# Altium schematic sheet cc2530.SchDoc
size A3
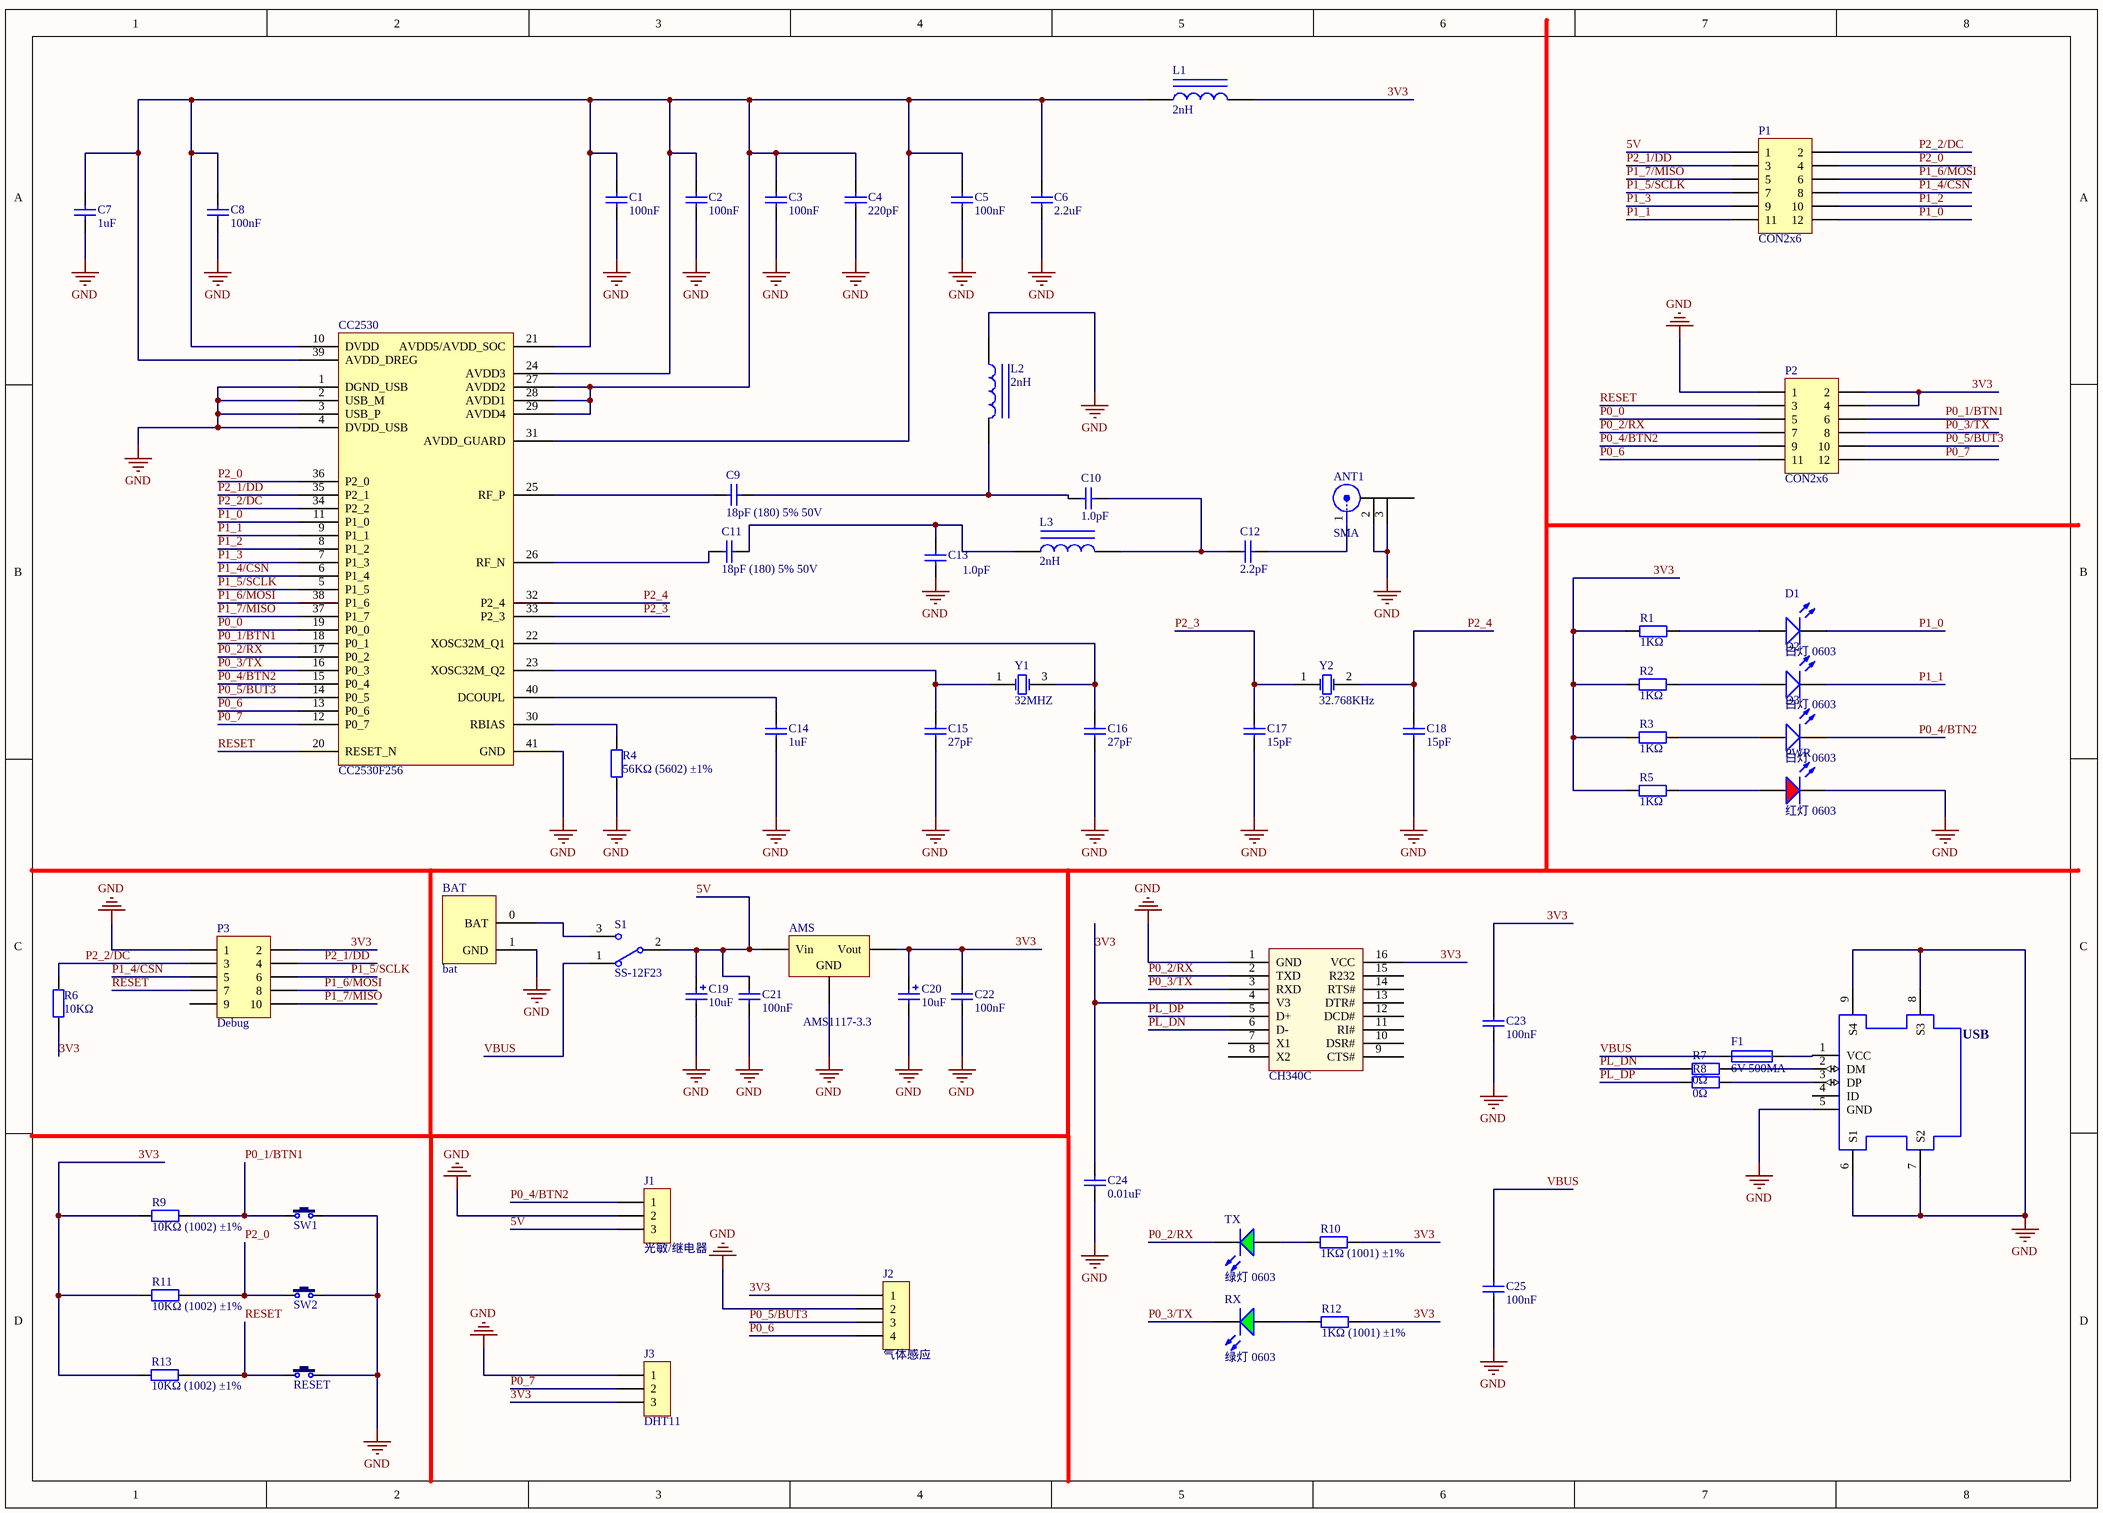
[diagram p0: cc2530.SchDoc]

## Parts
AMS  AMS1117-3.3  [SOT-223]
ANT1  SMA  [SMA-KE]
BAT  bat  [BAT]
C1  100nF  [0603_C]
C2  100nF  [0603_C]
C3  100nF  [0603_C]
C4  220pF  [0603_C]
C5  100nF  [0603_C]
C6  2.2uF  [0603_C]
C7  1uF  [0603_C]
C8  100nF  [0603_C]
C9  18pF (180) 5% 50V  [0603_C]
C10  1.0pF  [0805_C]
C11  18pF (180) 5% 50V  [0603_C]
C12  2.2pF  [0603_C]
C13  1.0pF  [0805_C]
C14  1uF  [0603_C]
C15  27pF  [0603_C]
C16  27pF  [0603_C]
C17  15pF  [0603_C]
C18  15pF  [0603_C]
C19  10uF  [CASE-A_3216]
C20  10uF  [CASE-A_3216]
C21  100nF  [0603_C]
C22  100nF  [0603_C]
C23  100nF  [0603_C]
C24  0.01uF  [0603_C]
C25  100nF  [0603_C]
CC2530  CC2530F256  [PVQFN-N40]
CH340C  CH340C  [SOIC-16_150mil]  (value not drawn)
D1  白灯 0603  [0603_LED_S1]
D2  白灯 0603  [0603_LED_S1]
D3  白灯 0603  [0603_LED_S1]
F1  6V 500MA  [0805]
J1  光敏/继电器  [HDR1X3]
J2  气体感应  [HDR1X4]
J3  DHT11  [HDR1X3]
L1  2nH  [0402_L]
L2  2nH  [0402_L]
L3  2nH  [0402_L]
P1  CON2x6  [CON2X6]
P2  CON2x6  [CON2X6]
P3  Debug  [DEBUG10]
PWR  红灯 0603  [0603_LED_S1]
R1  1KΩ  [0603_R]
R2  1KΩ  [0603_R]
R3  1KΩ  [0603_R]
R4  56KΩ (5602) ±1%  [0603_R]
R5  1KΩ  [0603_R]
R6  10KΩ  [0603_R]
R7  0Ω  [0603_R]
R8  0Ω  [0603_R]
R9  10KΩ (1002) ±1%  [0603_R]
R10  1KΩ (1001) ±1%  [0603_R]
R11  10KΩ (1002) ±1%  [0603_R]
R12  1KΩ (1001) ±1%  [0603_R]
R13  10KΩ (1002) ±1%  [0603_R]
RESET  6x6x5  [TSW SMD-3*6*2.5]  (value not drawn)
RX  绿灯 0603  [0603_LED_S1]
S1  SS-12F23  [SS-12F23]
SW1  6x6x5  [TSW SMD-3*6*2.5]  (value not drawn)
SW2  6x6x5  [TSW SMD-3*6*2.5]  (value not drawn)
TX  绿灯 0603  [0603_LED_S1]
USB  Mini USB  [SMT-MINI USB]  (value not drawn)
Y1  32MHZ  [SMD-3225_4P]
Y2  32.768KHz  [SMD-3215_2P FC - 135]

## Nets
GND: AMS.1(GND) ANT1.2 ANT1.3 BAT.1(GND) C1.1 C2.1 C3.1 C4.1 C5.1 C6.1 C7.1 C8.1 C13.1 C14.1 C15.1 C16.1 C17.1 C18.1 C19.2 C20.2 C21.1 C22.1 C23.1 C24.1 C25.1 CC2530.1(DGND_USB) CC2530.2(USB_M) CC2530.3(USB_P) CC2530.4(DVDD_USB) CC2530.41(GND) CH340C.1(GND) J1.2 J2.2 J3.1 L2.1 P2.1 P3.1 PWR.K R4.1 RESET.2 SW1.2 SW2.2 USB.5(GND) USB.6(S1) USB.7(S2) USB.8(S3) USB.9(S4)
3V3: AMS.2(Vout) C20.1 C22.2 C23.2 C24.2 CH340C.4(V3) CH340C.16(VCC) J2.1 J3.3 L1.2 P2.2 P2.4 P3.2 R1.1 R2.1 R3.1 R5.1 R6.1 R9.1 R10.2 R11.1 R12.2 R13.1
5V: AMS.3(Vin) C19.1 C21.2 J1.3 P1.1 S1.2
P0_0: CC2530.19(P0_0) P2.5
P0_1/BTN1: CC2530.18(P0_1) P2.6 R9.2 SW1.1
P0_2/RX: CC2530.17(P0_2) CH340C.2(TXD) P2.7 TX.K
P0_3/TX: CC2530.16(P0_3) CH340C.3(RXD) P2.8 RX.K
P0_4/BTN2: CC2530.15(P0_4) D3.K J1.1 P2.9
P0_5/BUT3: CC2530.14(P0_5) J2.3 P2.10
P0_6: CC2530.13(P0_6) J2.4 P2.11
P0_7: CC2530.12(P0_7) J3.2 P2.12
P1_0: CC2530.11(P1_0) D1.K P1.12
P1_1: CC2530.9(P1_1) D2.K P1.11
P1_2: CC2530.8(P1_2) P1.10
P1_3: CC2530.7(P1_3) P1.9
P1_4/CSN: CC2530.6(P1_4) P1.8 P3.5
P1_5/SCLK: CC2530.5(P1_5) P1.7 P3.6
P1_6/MOSI: CC2530.38(P1_6) P1.6 P3.8
P1_7/MISO: CC2530.37(P1_7) P1.5 P3.10
P2_0: CC2530.36(P2_0) P1.4 R11.2 SW2.1
P2_1/DD: CC2530.35(P2_1) P1.3 P3.4
P2_2/DC: CC2530.34(P2_2) P1.2 P3.3 R6.2
P2_3: C17.2 CC2530.33(P2_3) Y2.1(OSC1)
P2_4: C18.2 CC2530.32(P2_4) Y2.2(OSC2)
PL_DN: CH340C.6(D-) R7.1
PL_DP: CH340C.5(D+) R8.1
RESET: CC2530.20(RESET_N) P2.3 P3.7 R13.2 RESET.1
VBUS: C25.2 F1.1 S1.1
NetANT1_1: ANT1.1 C12.2
NetBAT_0: BAT.0(BAT) S1.3
NetC1_2: C1.2 C2.2 C3.2 C4.2 C5.2 C6.2 C7.2 C8.2 CC2530.10(DVDD) CC2530.21(AVDD5/AVDD_SOC) CC2530.24(AVDD3) CC2530.27(AVDD2) CC2530.28(AVDD1) CC2530.29(AVDD4) CC2530.31(AVDD_GUARD) CC2530.39(AVDD_DREG) L1.1
NetC9_1: C9.1 CC2530.25(RF_P)
NetC9_2: C9.2 C10.1 L2.2
NetC10_2: C10.2 C12.1 L3.2
NetC11_1: C11.1 CC2530.26(RF_N)
NetC11_2: C11.2 C13.2 L3.1
NetC14_2: C14.2 CC2530.40(DCOUPL)
NetC15_2: C15.2 CC2530.23(XOSC32M_Q2) Y1.1(OSC1)
NetC16_2: C16.2 CC2530.22(XOSC32M_Q1) Y1.3(OSC2)
NetCC2530_30: CC2530.30(RBIAS) R4.2
NetD1_A: D1.A R1.2
NetD2_A: D2.A R2.2
NetD3_A: D3.A R3.2
NetF1_2: F1.2 USB.1(VCC)
NetPWR_A: PWR.A R5.2
NetR7_2: R7.2 USB.2(DM)
NetR8_2: R8.2 USB.3(DP)
NetR10_1: R10.1 TX.A
NetR12_1: R12.1 RX.A

Not connected (* = marked no-connect by the designer): CH340C 7(X1) 8(X2) 9(CTS#) 10(DSR#) 11(RI#) 12(DCD#) 13(DTR#) 14(RTS#) 15(R232); P3 9; USB 4(ID)

## Library data of the parts
AMS = SOT-223 AMS1117-3.3: 低压差线性稳压(LDO); ComponentLink1Description: 供应商链接; ComponentLink1URL: http://www.szlcsc.com/product/details_6652.html; Package: SOT-223; Supplier: LC; SuppliersPartNumber: C6186
C1-C3 C5 C8 C14-C18 C21-C25 = 0603 100nF (104) 10% 50V: 贴片电容; ComponentLink1Description: 供应商链接; ComponentLink1URL: http://www.szlcsc.com/product/details_15331.html; Package: 0603; Supplier: LC; SuppliersPartNumber: C14663
C4 = 0603 220pF (221) 10% 50V: 贴片电容; ComponentLink1Description: 供应商链接; ComponentLink1URL: http://www.szlcsc.com/product/details_1955.html; Package: 0603; Supplier: LC; SuppliersPartNumber: C1603
C6 C12 = 0603 2.2uF (225) 10% 16V: 贴片电容; ComponentLink1Description: 供应商链接; ComponentLink1URL: http://www.szlcsc.com/product/details_24366.html; Package: 0603; Supplier: LC; SuppliersPartNumber: C23630
C7 = 0603 1uF (105) 10% 50V: 贴片电容; ComponentLink1Description: 供应商链接; ComponentLink1URL: http://www.szlcsc.com/product/details_16531.html; Package: 0603; Supplier: LC; SuppliersPartNumber: C15849
C9 C11 = 0603 18pF (180) 5% 50V: 贴片电容; ComponentLink1Description: 供应商链接; ComponentLink1URL: http://www.szlcsc.com/product/details_1999.html; Package: 0603; Supplier: LC; SuppliersPartNumber: C1647
C10 C13 = 0805 1.0pF (010) 0.25pF 50V: 贴片电容; ComponentLink1Description: 供应商链接; ComponentLink1URL: http://www.szlcsc.com/product/details_15644.html; Package: 0805; Supplier: LC; SuppliersPartNumber: C14971
C19 C20 = 3216 10uF (106) 10% 16V: 钽电容; ComponentLink1Description: 供应商链接; ComponentLink1URL: http://www.szlcsc.com/product/details_7643.html; Package: 3216; Supplier: LC; SuppliersPartNumber: C7171
CC2530 = CC2530
CH340C = CH340C: 技术支持，联系售后: 封装库来自淘宝卖家 ID：黄晶宝石; 唯一出售店铺网址: https://shop463601444.taobao.com
D1-D3 = 0603 白灯: 发光二极管; ComponentLink1Description: 供应商链接; ComponentLink1URL: http://www.szlcsc.com/product/details_2663.html; Package: 0603; Supplier: LC; SuppliersPartNumber: C2290
F1 = FUSE: 保险丝
J1 J3 = CON3: 连接器
J2 = CON4: 连接器
L1-L3 = 0402 2.7nH 0.3nH: 贴片电感; ComponentLink1Description: 供应商链接; ComponentLink1URL: http://www.szlcsc.com/product/details_27872.html; Package: 0402; Supplier: LC; SuppliersPartNumber: C27123
P3 = Header 5X2: Header, 5-Pin, Dual row
PWR = 0603 红灯: 发光二极管; ComponentLink1Description: 供应商链接; ComponentLink1URL: http://www.szlcsc.com/product/details_2659.html; Package: 0603; Supplier: LC; SuppliersPartNumber: C2286
R1-R3 R5 = 0603 1.1KΩ (1101) 1%: 贴片电阻; ComponentLink1Description: 供应商链接; ComponentLink1URL: http://www.szlcsc.com/product/details_23491.html; Package: 0603; Supplier: LC; SuppliersPartNumber: C22764
R4 = 0603 56KΩ (5602) 1%: 贴片电阻; ComponentLink1Description: 供应商链接; ComponentLink1URL: http://www.szlcsc.com/product/details_23933.html; Package: 0603; Supplier: LC; SuppliersPartNumber: C23206
R6 R9 R11 R13 = 0603 10KΩ (1002) 1%: 贴片电阻; ComponentLink1Description: 供应商链接; ComponentLink1URL: http://www.szlcsc.com/product/details_26547.html; Package: 0603; Supplier: LC; SuppliersPartNumber: C25804
R7 R8 = 0603 0Ω (0R0) 1%: 贴片电阻; ComponentLink1Description: 供应商链接; ComponentLink1URL: http://www.szlcsc.com/product/details_21903.html; Package: 0603; Supplier: LC; SuppliersPartNumber: C21189
R10 R12 = 0603 1KΩ (1001) 1%: 贴片电阻; ComponentLink1Description: 供应商链接; ComponentLink1URL: http://www.szlcsc.com/product/details_21904.html; Package: 0603; Supplier: LC; SuppliersPartNumber: C21190
RESET SW1 SW2 = TSW DIP-6x6_V: 侧按直插6x6轻触开关; 版权归属: 封装库来自淘宝 ID：黄晶宝石; BOM名称: 直插6x6轻触开关; 技术支持，联系售后: https://shop463601444.taobao.com
RX TX = 0603 绿灯: 发光二极管; ComponentLink1Description: 供应商链接; ComponentLink1URL: http://www.szlcsc.com/product/details_73152.html; Package: 0603; Supplier: LC; SuppliersPartNumber: C72043
S1 = SSW-1P: 1路波动开关; BOM名称: 波动开关; 版权归属: 封装库来自淘宝 ID：黄晶宝石; 学习资源: https://shop463601444.taobao.com
USB = USB-1: IC; Manufacturer Part Number: USB Plug P/N: MUSB-B5-S-VT-02; Publisher1: Stephen Lui; Publisher2: Tianshen; ComponentLink1Description: Manufacturer Link; ComponentLink1URL: *; Manufacturer: *; Published: NOV.13,2009
Y1 = SMD-3225_4P  25MHZ 12PF 10PPM: 贴片晶振; ComponentLink1Description: 供应商链接; ComponentLink1URL: http://www.szlcsc.com/product/details_9526.html; Package: SMD-3225_4P; Supplier: LC; SuppliersPartNumber: C9006
Y2 = SMD-3215_2P 32.768KHz 20ppm 12.5pF: 贴片晶振; ComponentLink1Description: 供应商链接; ComponentLink1URL: http://www.szlcsc.com/product/details_33310.html; Package: SMD-3215_2P; Supplier: LC; SuppliersPartNumber: C32346